# EAGLE board regulator_plus_switch_multi (EAGLE 7.2.0)
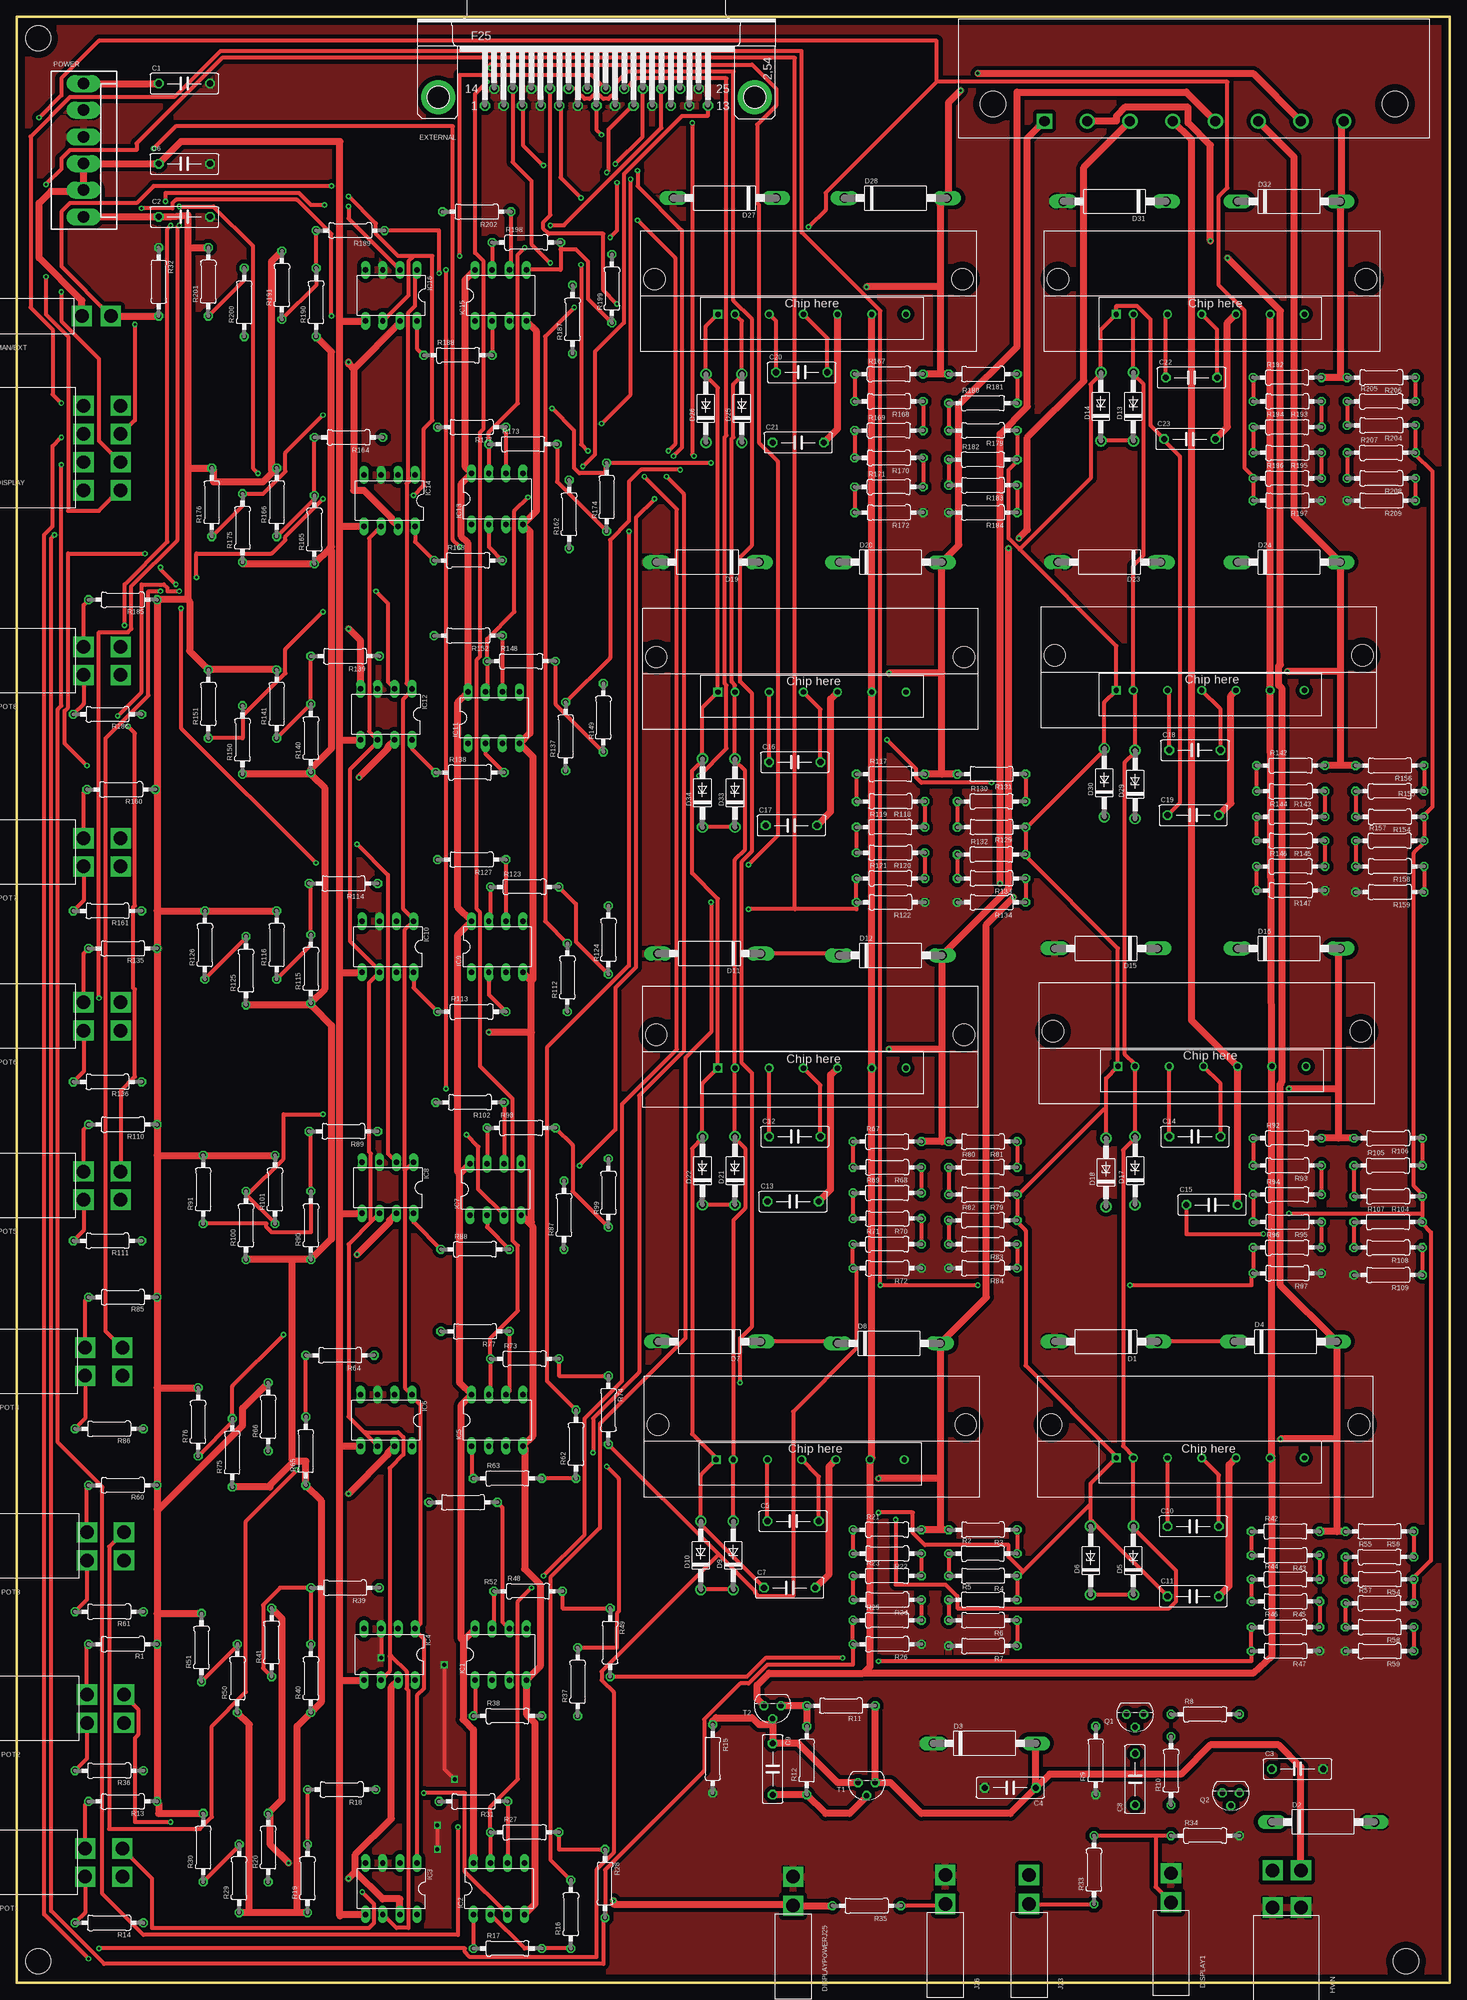
[diagram p2: board, top side]
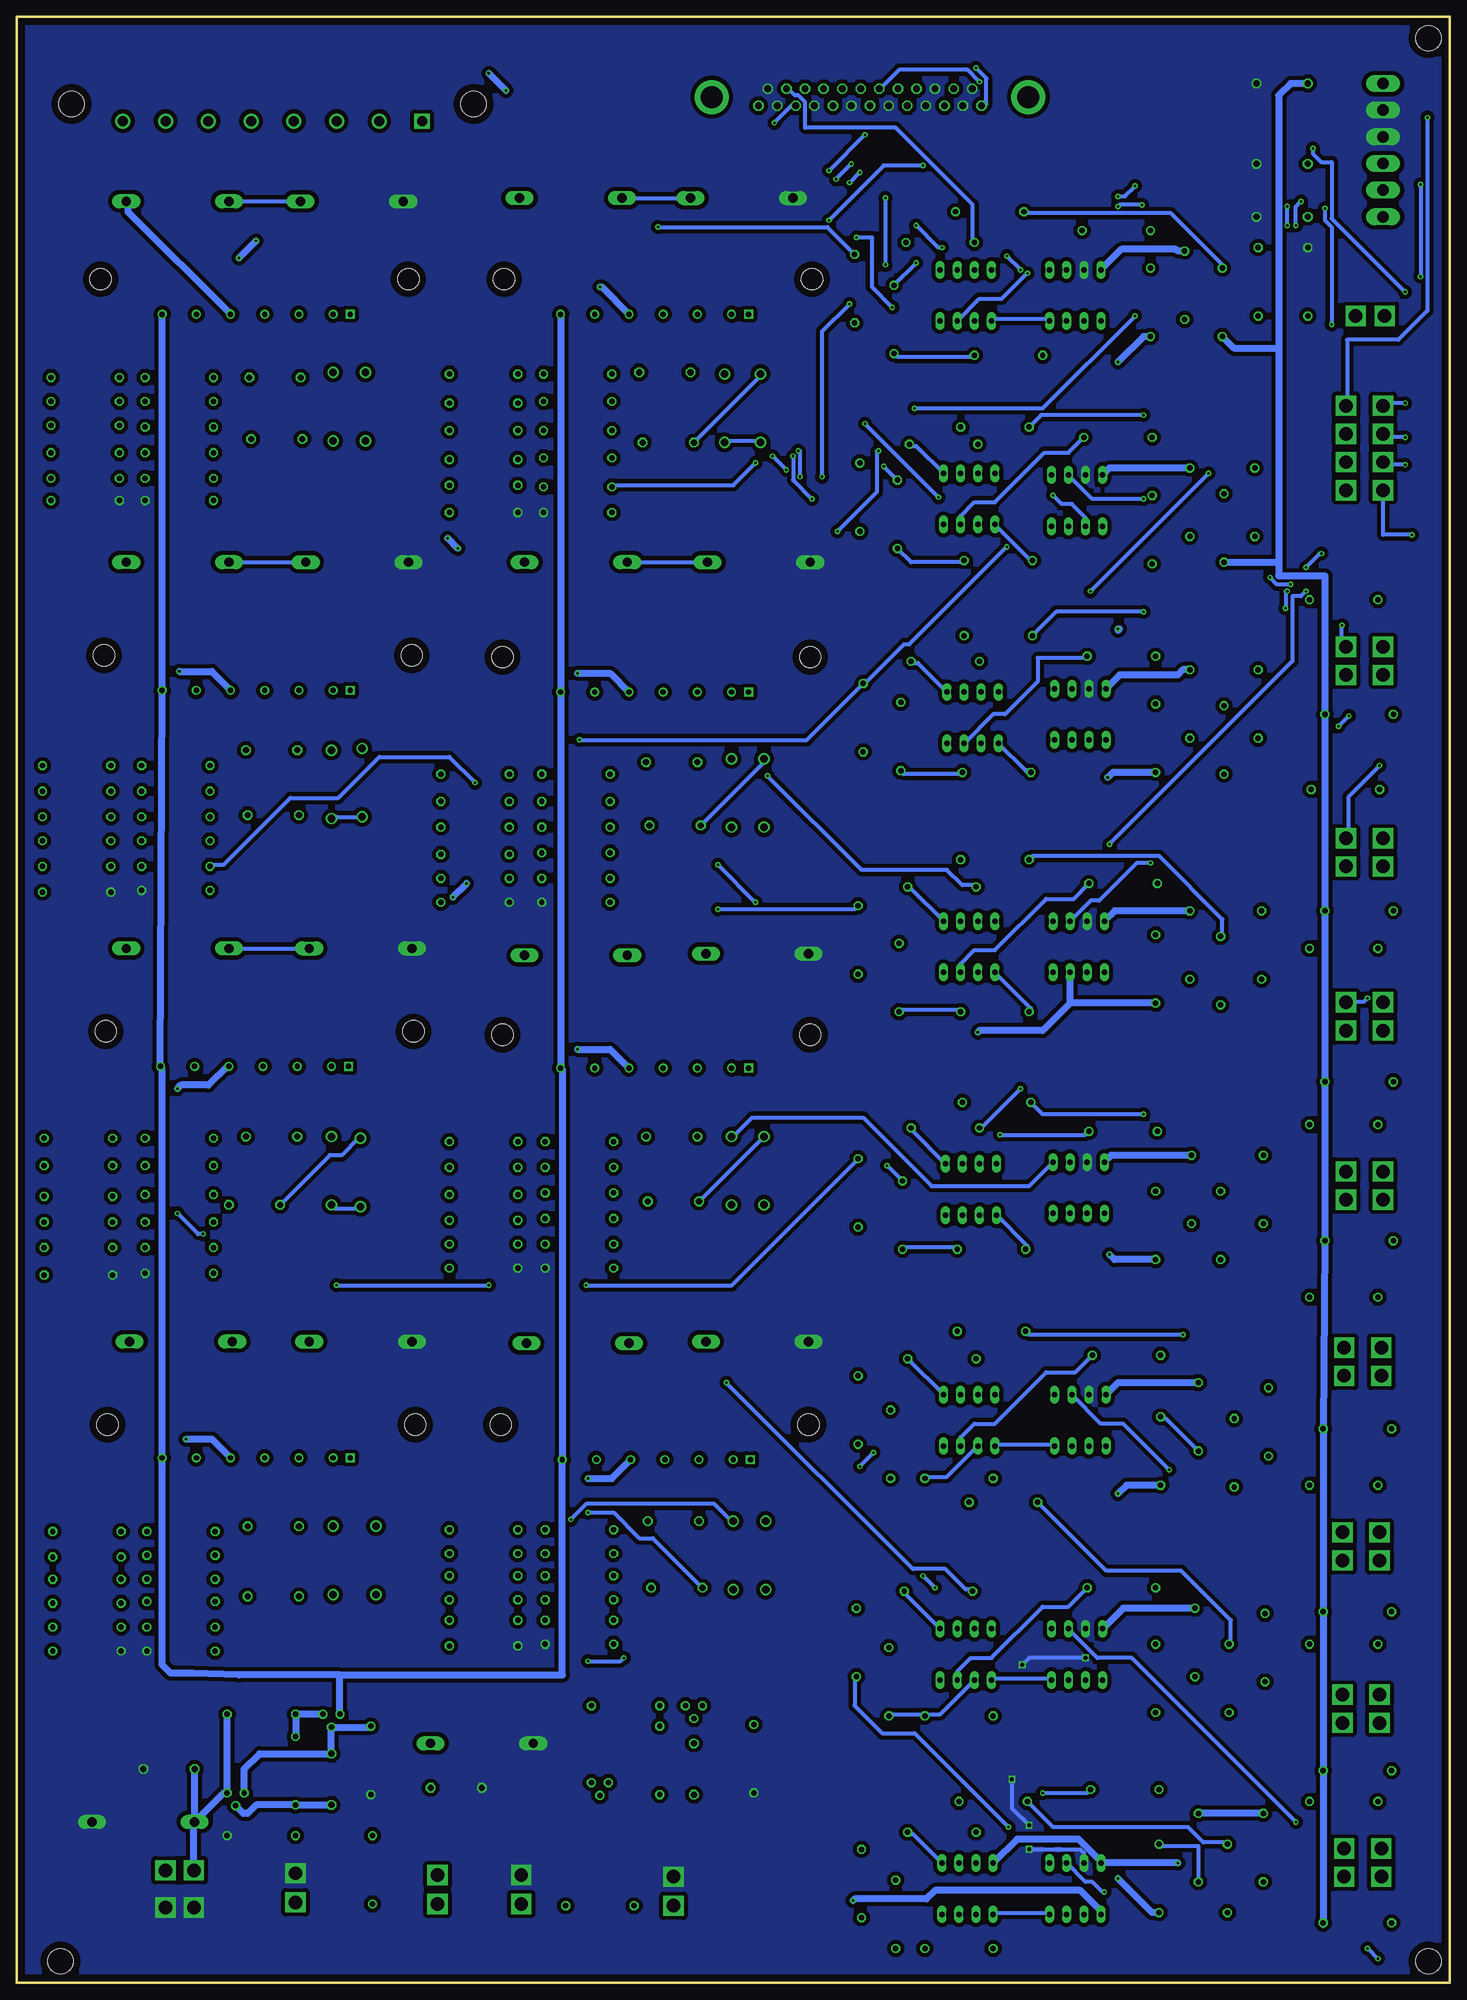
[diagram p3: board, bottom side, seen from below]

Size 212.85 x 292.1 mm. Coordinates in mm from the lower left corner, seen from the top.
Outline: 0,0 212.85,0 212.85,292.1 0,292.1 0,0
Copper layers (1*16): Top 0.035mm / dielectric 1.5mm / Bottom 0.035mm
Design rules "default *": minimum track width 24mil, minimum drill 15mil, track to track 8mil, track to pad 8mil, pad to pad 8mil, via to via 8mil, smd to smd 8mil, copper to edge 40mil, drill to drill 8mil, minimum pad ring 10mil, minimum via ring 8mil, stop-mask expansion 4mil, vias tented up to drill 0mil, thermal gap 10mil
Net classes: 0 default: width 0.61 mm, clearance 0.254 mm; 1 ground: width 0.61 mm, clearance 0.254 mm; 2 power: width 1.016 mm, clearance 0.254 mm
Holes 3.8 mm at 3.17,288.93 206.38,3.17 3.17,3.17

## Footprints (pad centres in the part's own frame; a part is rotated, then mirrored left to right if it is on the bottom)
C075-032X103 = drill 0.914 octagon: 1 -3.81,0; 2 3.81,0
C1702-15 = drill 1.397 long: A 7.62,0; C -7.62,0
DO41Z10 = drill 1.118: A 5.08,0; C -5.08,0
5669-8 = drill 2 square: P$1 0,0; P$2 -4.191,0; P$3 -8.382,0; P$4 -12.573,0; P$5 0,5.512; P$6 -4.191,5.512; P$7 -8.382,5.512; P$8 -12.573,5.512
5569-2 = drill 2 square: P$1 0,0; P$2 0,4.318
F25HP = drill 1.016 octagon: 1 -16.561,-1.27; 2 -13.792,-1.27; 3 -11.049,-1.27; 4 -8.28,-1.27; 5 -5.512,-1.27; 6 -2.769,-1.27; 7 0,-1.27; 8 2.769,-1.27; 9 5.512,-1.27; 10 8.28,-1.27; 11 11.049,-1.27; 12 13.792,-1.27; 13 16.561,-1.27; 14 -15.189,1.27; 15 -12.421,1.27; 16 -9.652,1.27; 17 -6.909,1.27; 18 -4.14,1.27; 19 -1.372,1.27; 20 1.372,1.27; 21 4.14,1.27; 22 6.909,1.27; 23 9.652,1.27; 24 12.421,1.27; 25 15.189,1.27 | drill 3.302 pad 5.08: G1 -23.52,0; G2 23.52,0
5669-4 = drill 2 square: P$1 0,0; P$2 -4.191,0; P$3 0,5.512; P$4 -4.191,5.512
DIL08 = drill 0.813 long: 1 -3.81,-3.81; 2 -1.27,-3.81; 3 1.27,-3.81; 4 3.81,-3.81; 5 3.81,3.81; 6 1.27,3.81; 7 -1.27,3.81; 8 -3.81,3.81
C247-050 = hole 3.2: 2.032,7.239; 47.752,7.239
640584-1 = drill 1.5 square: P$1 0,0 | drill 1.5: P$2 6.35,0; P$3 12.7,0; P$4 19.05,0; P$5 25.4,0; P$6 31.75,0; P$7 38.1,0; P$8 44.45,0 | hole 3.81: -7.62,2.54; 52.07,2.54
KK-156-6 = drill 1.7 pad 2.184 long: 1 -9.9,0; 2 -5.94,0; 3 -1.98,0; 4 1.98,0; 5 5.94,0; 6 9.9,0
TO92 = drill 0.813 octagon: 1 1.27,0; 2 0,1.905; 3 -1.27,0
0207/10 = drill 0.813 octagon: 1 -5.08,0; 2 5.08,0
7SIP = drill 0.8 square: P$1 0,0 | drill 0.8: P$2 2.54,0; P$3 7.62,0; P$4 12.7,0; P$5 17.78,0; P$6 22.86,0; P$7 27.94,0

## Placement (x,y rotation side)
C1  10n  [C075-032X103]  24.89,282.19 0 top
C2  10n  [C075-032X103]  24.89,262.38 0 top
C3  10n  [C075-032X103]  190.25,31.75 0 top
C4  10n  [C075-032X103]  147.57,28.96 180 top
C5  10p  [C075-032X103]  115.32,68.58 0 top
C6  10n  [C075-032X103]  24.89,270.26 0 top
C7  10p  [C075-032X103]  114.81,58.67 0 top
C8  1n  [C075-032X103]  166.12,30.23 90 top
C9  1n  [C075-032X103]  112.27,31.75 270 top
C10  10p  [C075-032X103]  174.75,67.82 0 top
C11  10p  [C075-032X103]  174.75,57.4 0 top
C12  10p  [C075-032X103]  115.57,125.73 0 top
C13  10p  [C075-032X103]  115.32,116.08 0 top
C14  10p  [C075-032X103]  175.01,125.73 0 top
C15  10p  [C075-032X103]  177.55,115.57 0 top
C16  10p  [C075-032X103]  115.57,181.36 0 top
C17  10p  [C075-032X103]  115.06,171.96 0 top
C18  10p  [C075-032X103]  175.01,183.13 0 top
C19  10p  [C075-032X103]  174.75,173.48 0 top
C20  10p  [C075-032X103]  116.59,239.27 0 top
C21  10p  [C075-032X103]  116.08,228.85 0 top
C22  10p  [C075-032X103]  174.5,238.51 0 top
C23  10p  [C075-032X103]  174.24,229.36 0 top
D1  P6KEXXA  [C1702-15]  161.8,95.25 180 top
D2  P6KEXXA  [C1702-15]  194.06,23.88 0 top
D3  P6KEXXA  [C1702-15]  143.76,35.56 0 top
D4  P6KEXXA  [C1702-15]  188.47,95.25 0 top
D5  1n4742  [DO41Z10]  165.86,62.74 90 top
D6  1n4742  [DO41Z10]  159.51,62.74 90 top
D7  P6KEXXA  [C1702-15]  102.87,95.25 180 top
D8  P6KEXXA  [C1702-15]  129.54,95 0 top
D9  1n4742  [DO41Z10]  106.43,63.5 90 top
D10  1n4742  [DO41Z10]  101.6,63.5 90 top
D11  P6KEXXA  [C1702-15]  102.87,152.91 180 top
D12  P6KEXXA  [C1702-15]  129.79,152.65 0 top
D13  1n4742  [DO41Z10]  165.86,234.19 90 top
D14  1n4742  [DO41Z10]  161.04,234.19 90 top
D15  P6KEXXA  [C1702-15]  161.8,153.67 180 top
D16  P6KEXXA  [C1702-15]  188.98,153.67 0 top
D17  1n4742  [DO41Z10]  166.12,120.65 90 top
D18  1n4742  [DO41Z10]  161.8,120.4 90 top
D19  P6KEXXA  [C1702-15]  102.62,211.07 180 top
D20  P6KEXXA  [C1702-15]  129.79,211.07 0 top
D21  1n4742  [DO41Z10]  106.68,120.65 90 top
D22  1n4742  [DO41Z10]  101.85,120.65 90 top
D23  P6KEXXA  [C1702-15]  162.31,211.07 180 top
D24  P6KEXXA  [C1702-15]  188.98,211.07 0 top
D25  1n4742  [DO41Z10]  107.7,233.93 90 top
D26  1n4742  [DO41Z10]  102.36,233.93 90 top
D27  P6KEXXA  [C1702-15]  105.16,265.18 180 top
D28  P6KEXXA  [C1702-15]  130.56,265.18 0 top
D29  1n4742  [DO41Z10]  166.12,178.05 90 top
D30  1n4742  [DO41Z10]  161.54,178.31 90 top
D31  P6KEXXA  [C1702-15]  163.07,264.67 180 top
D32  P6KEXXA  [C1702-15]  188.98,264.67 0 top
D33  1n4742  [DO41Z10]  106.68,176.78 90 top
D34  1n4742  [DO41Z10]  101.85,176.78 90 top
DISPLAY  5669-8  [5669-8]  9.91,221.74 270 top
DISPLAY1  5569-2  [5569-2]  171.45,11.94 0 top
DISPLAYPOWERJ25  5569-2  [5569-2]  115.32,11.43 0 top
EXTERNAL  [F25HP]  86.11,280.16 0 top
HVIN  5569-4  [5669-4]  190.75,11.18 0 top
IC1  LT1352PA  [DIL08]  71.88,48.77 0 top
IC2  LT1352PA  [DIL08]  71.63,13.97 0 top
IC3  DG419DJN  [DIL08]  55.63,13.97 180 top
IC4  DG419DJN  [DIL08]  55.37,48.77 180 top
IC5  LT1352PA  [DIL08]  71.37,83.57 0 top
IC6  DG419DJN  [DIL08]  54.86,83.57 180 top
IC7  LT1352PA  [DIL08]  71.12,117.86 0 top
IC8  DG419DJN  [DIL08]  55.12,118.11 180 top
IC9  LT1352PA  [DIL08]  71.37,153.92 0 top
IC10  DG419DJN  [DIL08]  55.12,153.92 180 top
IC11  LT1352PA  [DIL08]  70.87,187.96 0 top
IC12  DG419DJN  [DIL08]  54.86,188.47 180 top
IC13  LT1352PA  [DIL08]  71.37,220.47 0 top
IC14  DG419DJN  [DIL08]  55.37,220.22 180 top
IC15  LT1352PA  [DIL08]  71.88,250.7 0 top
IC16  DG419DJN  [DIL08]  55.63,250.7 180 top
J23  5569-2  [5569-2]  150.37,11.68 0 top
J26  5569-2  [5569-2]  137.92,11.68 0 top
KK1  SK125/50C247  [C247-050]  143,90.17 180 top
KK2  SK125/50C247  [C247-050]  201.42,90.17 180 top
KK3  SK125/50C247  [C247-050]  142.75,148.08 180 top
KK4  SK125/50C247  [C247-050]  142.75,204.22 180 top
KK5  SK125/50C247  [C247-050]  201.93,204.47 180 top
KK6  SK125/50C247  [C247-050]  142.49,260.35 180 top
KK7  SK125/50C247  [C247-050]  202.44,260.35 180 top
KK8  SK125/50C247  [C247-050]  201.68,148.59 180 top
MAN/EXT  5569-2  [5569-2]  9.65,247.65 270 top
OUT  640584-1  [640584-1]  152.65,276.61 0 top
POT1  5569-4  [5669-4]  10.16,15.75 270 top
POT2  5569-4  [5669-4]  10.41,38.61 270 top
POT3  5569-4  [5669-4]  10.41,62.74 270 top
POT4  5569-4  [5669-4]  10.16,90.17 270 top
POT5  5569-4  [5669-4]  9.91,116.33 270 top
POT6  5569-4  [5669-4]  9.91,141.48 270 top
POT7  5569-4  [5669-4]  9.91,165.86 270 top
POT8  5569-4  [5669-4]  9.91,194.31 270 top
POWER  [KK-156-6]  9.91,272.29 270 top
Q1  STX616-AP  [TO92]  166.12,39.88 180 top
Q2  STX616-AP  [TO92]  180.34,28.19 180 top
R1  20k  [0207/10]  15.75,50.29 180 top
R2  1M  [0207/10]  143.51,63.75 0 top
R3  1M  [0207/10]  143.51,67.31 180 top
R4  1M  [0207/10]  143.51,60.45 180 top
R5  25.5k  [0207/10]  143.51,56.9 0 top
R6  25.5k  [0207/10]  143.51,53.85 180 top
R7  25.5k  [0207/10]  143.51,50.04 180 top
R8  68  [0207/10]  176.53,39.88 0 top
R9  4.99M  [0207/10]  160.27,33.02 90 top
R10  1k  [0207/10]  171.45,31.5 90 top
R11  68  [0207/10]  122.43,41.15 180 top
R12  1k  [0207/10]  117.35,33.02 90 top
R13  20k  [0207/10]  15.75,26.92 180 top
R14  20k  [0207/10]  13.72,8.89 180 top
R15  4.99M  [0207/10]  103.38,33.27 270 top
R16  10k  [0207/10]  82.3,10.16 90 top
R17  40k  [0207/10]  72.9,5.08 0 top
R18  10k  [0207/10]  48.26,28.7 180 top
R19  17k  [0207/10]  43.18,15.49 90 top
R20  13k  [0207/10]  37.34,20.07 90 top
R21  1M  [0207/10]  129.29,67.31 0 top
R22  1M  [0207/10]  129.29,63.75 180 top
R23  1M  [0207/10]  129.29,60.45 0 top
R24  1M  [0207/10]  129.29,56.9 180 top
R25  1M  [0207/10]  129.29,53.85 0 top
R26  100k  [0207/10]  129.29,50.29 180 top
R27  10k  [0207/10]  75.44,22.35 0 top
R28  20k  [0207/10]  87.38,14.73 270 top
R29  16k  [0207/10]  33.02,15.49 90 top
R30  12.75k  [0207/10]  27.69,20.07 90 top
R31  10k  [0207/10]  67.82,26.92 180 top
R32  100k  [0207/10]  21.08,252.73 270 top
R33  90.9k  [0207/10]  160.02,16.76 90 top
R34  10k  [0207/10]  176.53,21.84 0 top
R35  294  [0207/10]  126.24,11.43 180 top
R36  20k  [0207/10]  13.72,31.5 180 top
R37  10k  [0207/10]  83.31,44.7 90 top
R38  40k  [0207/10]  72.9,39.62 0 top
R39  10k  [0207/10]  48.77,58.67 180 top
R40  17k  [0207/10]  43.69,45.21 90 top
R41  13k  [0207/10]  37.85,50.55 90 top
R42  1M  [0207/10]  188.47,67.06 0 top
R43  1M  [0207/10]  188.47,63.5 180 top
R44  1M  [0207/10]  188.47,59.94 0 top
R45  1M  [0207/10]  188.47,56.64 180 top
R46  1M  [0207/10]  188.47,52.83 0 top
R47  100k  [0207/10]  188.47,49.28 180 top
R48  10k  [0207/10]  75.95,58.17 0 top
R49  20k  [0207/10]  88.14,50.55 270 top
R50  16k  [0207/10]  32.77,45.21 90 top
R51  12.75k  [0207/10]  27.43,49.78 90 top
R52  10k  [0207/10]  66.29,71.37 180 top
R54  1M  [0207/10]  202.44,59.94 180 top
R55  1M  [0207/10]  202.44,63.25 0 top
R56  1M  [0207/10]  202.44,67.06 180 top
R57  25.5k  [0207/10]  202.44,56.39 0 top
R58  25.5k  [0207/10]  202.44,52.83 180 top
R59  25.5k  [0207/10]  202.44,49.28 180 top
R60  20k  [0207/10]  15.75,73.91 180 top
R61  20k  [0207/10]  13.72,55.12 180 top
R62  10k  [0207/10]  83.06,80.01 90 top
R63  40k  [0207/10]  72.9,74.93 0 top
R64  10k  [0207/10]  48.01,93.22 180 top
R65  17k  [0207/10]  42.93,78.99 90 top
R66  13k  [0207/10]  37.34,84.07 90 top
R67  1M  [0207/10]  129.29,124.97 0 top
R68  1M  [0207/10]  129.29,121.16 180 top
R69  1M  [0207/10]  129.29,117.35 0 top
R70  1M  [0207/10]  129.29,113.54 180 top
R71  1M  [0207/10]  129.29,109.73 0 top
R72  100k  [0207/10]  129.29,106.17 180 top
R73  10k  [0207/10]  75.44,92.71 0 top
R74  20k  [0207/10]  87.88,85.09 270 top
R75  16k  [0207/10]  32,78.74 90 top
R76  12.75k  [0207/10]  26.92,83.31 90 top
R77  10k  [0207/10]  68.07,96.77 180 top
R79  1M  [0207/10]  143.51,117.09 180 top
R80  1M  [0207/10]  143.51,121.16 0 top
R81  1M  [0207/10]  143.51,124.97 180 top
R82  25.5k  [0207/10]  143.51,113.28 0 top
R83  25.5k  [0207/10]  143.51,109.73 180 top
R84  25.5k  [0207/10]  143.51,106.17 180 top
R85  20k  [0207/10]  15.75,101.85 180 top
R86  20k  [0207/10]  13.72,82.3 180 top
R87  10k  [0207/10]  81.28,114.05 90 top
R88  40k  [0207/10]  68.07,108.97 0 top
R89  10k  [0207/10]  48.51,126.49 180 top
R90  17k  [0207/10]  43.69,112.52 90 top
R91  13k  [0207/10]  27.69,117.86 90 top
R92  1M  [0207/10]  188.72,125.48 0 top
R93  1M  [0207/10]  188.72,121.41 180 top
R94  1M  [0207/10]  188.72,117.09 0 top
R95  1M  [0207/10]  188.72,113.03 180 top
R96  1M  [0207/10]  188.72,109.22 0 top
R97  100k  [0207/10]  188.72,105.41 180 top
R98  10k  [0207/10]  74.93,127 0 top
R99  20k  [0207/10]  87.88,117.35 90 top
R100  16k  [0207/10]  34.04,112.52 90 top
R101  12.75k  [0207/10]  38.35,117.86 90 top
R102  10k  [0207/10]  67.31,130.81 180 top
R104  1M  [0207/10]  203.71,116.84 180 top
R105  1M  [0207/10]  203.71,121.41 0 top
R106  1M  [0207/10]  203.71,125.48 180 top
R107  25.5k  [0207/10]  203.71,113.03 0 top
R108  25.5k  [0207/10]  203.71,109.22 180 top
R109  25.5k  [0207/10]  203.71,105.16 180 top
R110  20k  [0207/10]  15.75,127.51 180 top
R111  20k  [0207/10]  13.46,110.24 180 top
R112  10k  [0207/10]  81.79,149.35 90 top
R113  40k  [0207/10]  67.56,144.27 0 top
R114  10k  [0207/10]  48.51,163.32 180 top
R115  17k  [0207/10]  43.69,150.62 90 top
R116  13k  [0207/10]  38.61,154.18 90 top
R117  1M  [0207/10]  129.79,179.58 0 top
R118  1M  [0207/10]  129.79,175.51 180 top
R119  1M  [0207/10]  129.79,171.7 0 top
R120  1M  [0207/10]  129.79,167.89 180 top
R121  1M  [0207/10]  129.79,164.08 0 top
R122  100k  [0207/10]  129.79,160.53 180 top
R123  10k  [0207/10]  75.44,162.81 0 top
R124  20k  [0207/10]  87.88,154.94 90 top
R125  16k  [0207/10]  34.04,150.37 90 top
R126  12.75k  [0207/10]  27.94,154.18 90 top
R127  10k  [0207/10]  67.56,166.88 180 top
R129  1M  [0207/10]  144.78,171.7 180 top
R130  1M  [0207/10]  144.78,175.51 0 top
R131  1M  [0207/10]  144.78,179.58 180 top
R132  25.5k  [0207/10]  144.78,167.64 0 top
R133  25.5k  [0207/10]  144.78,164.08 180 top
R134  25.5k  [0207/10]  144.78,160.53 180 top
R135  20k  [0207/10]  15.75,153.67 180 top
R136  20k  [0207/10]  13.46,133.86 180 top
R137  10k  [0207/10]  81.53,185.17 90 top
R138  40k  [0207/10]  67.31,179.83 0 top
R139  10k  [0207/10]  48.77,197.1 180 top
R140  17k  [0207/10]  43.69,184.91 90 top
R141  13k  [0207/10]  38.61,189.99 90 top
R142  1M  [0207/10]  189.23,180.85 0 top
R143  1M  [0207/10]  189.23,177.04 180 top
R144  1M  [0207/10]  189.23,173.23 0 top
R145  1M  [0207/10]  189.23,169.67 180 top
R146  1M  [0207/10]  189.23,165.86 0 top
R147  100k  [0207/10]  189.23,162.31 180 top
R148  10k  [0207/10]  74.93,196.34 0 top
R149  20k  [0207/10]  87.12,187.96 90 top
R150  16k  [0207/10]  33.53,184.66 90 top
R151  12.75k  [0207/10]  28.45,189.99 90 top
R152  10k  [0207/10]  67.06,200.15 180 top
R154  1M  [0207/10]  203.96,173.23 180 top
R155  1M  [0207/10]  203.96,177.04 0 top
R156  1M  [0207/10]  203.96,180.85 180 top
R157  25.5k  [0207/10]  203.96,169.67 0 top
R158  25.5k  [0207/10]  203.96,165.86 180 top
R159  25.5k  [0207/10]  203.96,162.05 180 top
R160  20k  [0207/10]  15.49,177.29 180 top
R161  20k  [0207/10]  13.46,159.26 180 top
R162  10k  [0207/10]  82.04,218.19 90 top
R163  40k  [0207/10]  67.06,211.33 0 top
R164  10k  [0207/10]  49.28,229.62 180 top
R165  17k  [0207/10]  44.2,215.9 90 top
R166  13k  [0207/10]  38.61,219.96 90 top
R167  1M  [0207/10]  129.54,239.01 0 top
R168  1M  [0207/10]  129.54,234.95 180 top
R169  1M  [0207/10]  129.54,230.63 0 top
R170  1M  [0207/10]  129.54,226.57 180 top
R171  1M  [0207/10]  129.54,222.25 0 top
R172  100k  [0207/10]  129.54,218.44 180 top
R173  10k  [0207/10]  75.18,228.6 0 top
R174  20k  [0207/10]  87.63,220.73 90 top
R175  16k  [0207/10]  33.53,216.15 90 top
R176  12.75k  [0207/10]  28.96,219.96 90 top
R177  10k  [0207/10]  67.56,231.14 180 top
R179  1M  [0207/10]  143.51,230.63 180 top
R180  1M  [0207/10]  143.51,234.7 0 top
R181  1M  [0207/10]  143.51,239.01 180 top
R182  25.5k  [0207/10]  143.51,226.31 0 top
R183  25.5k  [0207/10]  143.51,222.5 180 top
R184  25.5k  [0207/10]  143.51,218.44 180 top
R185  20k  [0207/10]  15.75,205.49 180 top
R186  20k  [0207/10]  13.46,188.47 180 top
R187  10k  [0207/10]  82.55,247.14 90 top
R188  40k  [0207/10]  65.53,241.81 0 top
R189  10k  [0207/10]  49.53,260.35 180 top
R190  17k  [0207/10]  44.45,249.68 90 top
R191  13k  [0207/10]  39.37,252.22 90 top
R192  1M  [0207/10]  188.72,238.51 0 top
R193  1M  [0207/10]  188.72,234.95 180 top
R194  1M  [0207/10]  188.72,231.14 0 top
R195  1M  [0207/10]  188.72,227.33 180 top
R196  1M  [0207/10]  188.72,223.52 0 top
R197  100k  [0207/10]  188.72,220.22 180 top
R198  10k  [0207/10]  75.69,258.57 0 top
R199  20k  [0207/10]  88.39,251.71 90 top
R200  16k  [0207/10]  33.78,249.68 90 top
R201  12.75k  [0207/10]  28.45,252.73 90 top
R202  10k  [0207/10]  68.33,263.14 180 top
R204  1M  [0207/10]  202.69,231.39 180 top
R205  1M  [0207/10]  202.69,234.95 0 top
R206  1M  [0207/10]  202.69,238.51 180 top
R207  25.5k  [0207/10]  202.69,227.33 0 top
R208  25.5k  [0207/10]  202.69,223.52 180 top
R209  25.5k  [0207/10]  202.69,220.22 180 top
T1  ZTX560  [TO92]  126.24,29.72 180 top
T2  ZTX560  [TO92]  112.27,41.15 180 top
U$1  PA97  [7SIP]  163.32,77.98 0 top
U$2  PA97  [7SIP]  104.14,135.89 0 top
U$3  PA97  [7SIP]  163.58,136.14 0 top
U$4  PA97  [7SIP]  103.89,77.72 0 top
U$5  PA97  [7SIP]  104.14,191.77 0 top
U$6  PA97  [7SIP]  163.32,192.02 0 top
U$7  PA97  [7SIP]  104.14,247.9 0 top
U$8  PA97  [7SIP]  163.32,247.9 0 top

## Tracks (layer width: path | path; a pad name or v marks a point on that pad's centre or on a via)
+5V  (via drill 0.38)
  Top 1.016: MAN/EXT.P$1 9.65,249.94 3.3,256.29 3.3,264.41 5.08,266.19 9.75,266.19 POWER.5 POWER.4 21.03,270.31 C6.1 24.38,273.56 48.01,273.56 48.01,246.89 | 48.01,9.91 48.01,10.16 | 48.01,10.16 48.01,44.96 | 48.01,44.96 48.01,79.76 | 48.01,79.76 48.01,114.3 | 48.01,114.3 48.01,150.11 | 48.01,150.11 48.01,184.66 | 48.01,184.66 48.01,216.41 | 48.01,216.41 48.01,246.89 | R35.2 DISPLAYPOWERJ25.P$1 115.06,11.68 88.65,11.68 v88.65,12.19 | 48.01,79.76 IC6.5 | 48.01,114.3 IC8.5 | 48.01,150.11 IC10.5 | 48.01,184.66 IC12.5 | 48.01,44.96 IC4.5 | 48.01,216.41 IC14.5 | 48.01,10.16 IC3.5 | 48.01,246.89 IC16.5
  Bottom 1.016: v88.65,12.19 88.39,12.45 77.72,12.45 76.45,13.72 54.86,13.72 51.82,10.67 IC3.5
+15V  (via drill 0.38)
  Top 1.016: POWER.6 C2.1 22.86,262.38 25.4,262.64 25.4,257.81 | 25.4,257.81 25.4,225.04 | 25.4,225.04 25.4,205.49 | 25.4,205.49 R185.1 20.83,177.04 | R160.1 20.83,177.04 | 20.83,177.04 20.83,159.26 | 20.83,159.26 R135.1 | 21.08,153.67 R135.1 | R135.1 R110.1 20.83,122.94 | 20.83,122.94 R85.1 20.83,88.39 | 20.83,88.39 R60.1 20.83,70.36 | 20.83,70.36 20.83,54.86 | 20.83,54.86 R1.1 R13.1 21.08,26.67 21.08,25.15 R30.2 | IC15.8 66.55,252.98 66.55,225.3 IC13.8 66.04,222.76 66.04,214.88 67.06,213.87 IC11.8 65.53,190.25 65.53,159.77 IC9.8 65.53,155.7 65.53,120.4 65.79,120.14 | 65.79,120.14 IC7.8 | 65.79,120.14 65.79,89.15 IC5.8 66.04,85.85 66.04,51.05 66.29,50.8 | IC2.8 67.82,37.59 66.29,39.12 66.29,50.8 | IC1.8 66.29,50.8 | R41.2 39.37,54.1 39.37,27.18 R20.2 37.59,24.89 37.59,20.57 v40.39,17.78 | v49.28,201.17 51.05,199.39 IC12.4 | R141.2 R151.2 25.65,197.87 25.65,205.23 25.4,205.49 | 20.83,54.86 R51.2 | 20.83,88.39 R76.2 | R66.2 33.53,85.34 33.53,82.8 21.08,70.36 20.83,70.36 | 20.83,122.94 R91.2 R101.2 | 20.83,159.26 R126.2 R116.2 | 25.4,225.04 R176.2 29.21,224.79 29.21,223.01 36.58,223.01 38.1,224.54 | 25.4,257.81 R201.2 | 38.1,224.54 R166.2 | R191.2 37.85,255.78 37.85,224.79 38.1,224.54
  Bottom 1.016: 49.28,200.91 49.15,201.04 | 49.15,201.04 49.02,201.17 | IC4.4 48.51,55.63 R41.2 | v40.39,17.78 IC3.4 51.82,18.03 55.12,21.34 64.26,21.34 IC2.8 | v49.28,201.17 49.15,201.04 | IC12.4 49.02,194.31 40.39,194.31 39.62,195.07 R141.2 | IC6.4 49.28,89.15 R66.2 | IC8.4 50.29,122.94 R101.2 | IC10.4 49.78,159.26 R116.2 | IC14.4 50.55,225.04 R166.2 | IC16.4 48.77,257.56 40.64,257.56 40.39,257.3 R191.2 | R30.2 R20.2
-15V  (via drill 0.38, 0.6)
  Top 1.016: POWER.1 C1.1 | IC15.4 77.22,245.36 77.22,218.69 IC13.4 76.2,215.65 76.2,185.67 IC11.4 76.71,182.12 76.71,149.1 76.45,148.84 | IC2.4 76.96,11.68 76.96,38.61 75.69,39.88 IC1.4 77.72,46.99 77.72,59.18 75.44,61.47 75.44,79.5 IC5.4 76.71,81.28 76.71,112.27 76.2,112.78 | 76.2,112.78 IC7.4 | 76.45,148.84 IC9.4 | 76.45,141.22 76.45,113.03 76.2,112.78 | 76.45,141.22 76.45,148.84 | IC4.7 55.63,43.94 55.63,24.38 50.29,19.05 50.29,16.51 | 50.29,16.51 54.36,12.45 56.9,12.45 IC3.7 | R19.1 41.66,10.41 | 41.66,10.41 34.54,10.41 | 34.54,10.41 R29.1 | R50.1 34.54,38.35 34.54,10.41 | 41.66,10.41 41.66,38.1 R40.1 45.21,41.66 45.21,71.63 R65.1 42.93,77.47 41.15,77.47 | v49.28,15.49 50.29,16.51 | 40.89,107.44 R90.1 46.74,110.49 46.74,142.24 43.94,145.03 R115.1 | 40.89,107.44 R100.1 | IC8.7 55.37,113.28 55.37,113.03 v50.55,108.2 | R75.1 37.59,73.66 37.59,73.91 41.15,77.47 | IC6.7 55.12,78.74 55.12,78.49 v49.28,72.64 | 40.89,107.44 40.89,77.72 41.15,77.47 | R125.1 43.69,145.29 R115.1 | R150.1 43.69,179.58 R140.1 | IC12.7 55.12,183.64 55.12,183.39 v50.8,179.07 | R115.1 45.72,147.57 45.72,177.55 43.94,179.32 R140.1 | IC14.7 55.63,217.42 55.63,217.68 51.56,221.74 50.04,221.74 50.04,239.78 | 50.04,239.78 56.9,246.63 IC16.7 | R175.1 33.53,210.82 R165.1 46.48,213.11 | R190.1 46.74,242.32 46.74,213.36 46.48,213.11 | 50.04,239.78 49.28,240.54 v49.28,240.79 | R140.1 43.69,180.34 46.74,183.39 46.74,212.85 46.48,213.11 | v70.1,141.22 76.45,141.22
  Bottom 1.016: C1.1 23.63,282.19 25.4,280.42 25.4,242.82 | 25.4,242.82 25.4,211.07 | 25.4,211.07 25.4,209.04 18.54,209.04 R186.1 R161.1 R136.1 R111.1 18.54,109.98 R86.1 R61.1 R36.1 R14.1 18.8,8.64 | v49.28,15.49 44.2,10.41 R19.1 | v50.55,108.2 49.78,107.44 R90.1 | v49.28,72.64 48.01,73.91 R65.1 | 56.39,145.54 IC10.7 | R115.1 56.39,145.54 | v50.8,179.07 50.04,179.83 R140.1 | R200.1 32,242.82 25.4,242.82 | R175.1 25.4,211.07 | v49.28,240.79 45.47,244.6 R190.1 | v70.1,141.22 69.85,141.48 60.45,141.48 56.39,145.54
  other vias: 21.08,282.19
CMD1  (via drill 0.38)
  Top 0.61: R16.2 79.25,18.29 79.25,60.2 86.61,67.56 86.61,83.06 99.31,95.76 99.31,137.41 103.12,141.22 v103.12,160.53 | v108.71,166.12 113.03,170.43 113.03,226.06 110.24,228.85 110.24,264.16 109.98,264.41 109.98,276.1 112.78,278.89 112.78,281.43 109.22,284.99 70.36,284.99 v70.36,284.48
  Bottom 0.61: v108.71,166.12 v103.12,160.53 | v70.36,284.48 68.83,282.96 68.83,279.15 69.09,278.89 EXTERNAL.1
CMD2  (via drill 0.38)
  Top 0.61: R37.2 89.15,49.78 89.15,54.86 89.41,55.12 89.41,74.93 v87.63,76.71 | v85.6,78.74 85.6,83.82 92.46,90.68 92.46,131.83 99.06,138.43 99.06,221.23 v96.52,223.77 | v96.77,227.58 97.79,228.6 97.79,256.29 v92.2,261.87 | v78.23,270 75.18,273.05 75.18,278.89 EXTERNAL.3
  Bottom 0.61: v85.6,78.74 v87.63,76.71 | v96.52,223.77 96.52,227.58 v96.77,227.58 | v92.2,261.87 84.07,270 v78.23,270
CMD3  (via drill 0.38)
  Top 0.61: R62.2 78.74,89.41 78.74,138.94 90.93,151.13 v90.93,215.65 | v84.84,227.58 83.82,228.6 v83.82,255.27 | v83.82,265.18 80.77,268.22 80.77,278.89 EXTERNAL.5
  Bottom 0.61: v90.93,215.65 85.09,221.49 85.09,227.58 v84.84,227.58 | v83.82,265.18 v83.82,255.27
CMD4  (via drill 0.38)
  Top 0.61: v83.57,121.41 88.9,126.75 88.9,147.83 91.95,150.88 91.95,217.68 v94.74,220.47 | v97.54,226.82 98.81,228.09 98.81,260.35 92.2,266.95 v92.2,269.24 | v86.87,274.57 86.11,275.34 EXTERNAL.7
  Bottom 0.61: v83.57,121.41 R87.2 | v94.74,220.47 97.54,223.27 v97.54,226.82 | v86.87,274.57 v92.2,269.24
CMD5  (via drill 0.38)
  Top 0.61: R112.2 78.49,157.73 78.49,244.6 v82.8,248.92 | v88.14,259.33 89.15,260.35 v89.15,267.46 | v87.63,268.99 87.88,269.24 87.88,275.34 91.44,278.89 EXTERNAL.9
  Bottom 0.61: v82.8,248.92 85.85,251.97 85.85,259.33 v88.14,259.33 | v87.63,268.99 v89.15,267.46
CMD6  (via drill 0.38)
  Top 0.61: R137.2 88.14,196.85 88.14,214.38 90.93,217.17 90.93,223.01 92.71,224.79 v98.55,224.79 | v100.58,226.82 100.33,227.08 v100.33,276.35
  Bottom 0.61: v100.58,226.82 v98.55,224.79 | v100.33,276.35 97.79,278.89 EXTERNAL.11
CMD7  (via drill 0.38)
  Top 0.61: v84.07,225.3 85.85,227.08 85.85,242.32 90.17,246.63 90.17,268.73 98.81,277.37 102.62,277.37 102.62,278.89 EXTERNAL.13
  Bottom 0.61: v84.07,225.3 R162.2
CMD8  (via drill 0.38)
  Top 0.61: v79.25,255.52 76.45,258.32 76.45,267.72 73.66,270.51 73.66,281.43 EXTERNAL.15
  Bottom 0.61: v79.25,255.52 R187.2
GND  (via drill 0.6)
  Top 0.61: IC4.3 v54.1,48.26 | v63.5,47.24 63.5,31.75 v65.02,30.23 | v62.48,23.37 v62.48,19.81
  Bottom 0.61: v54.1,48.26 62.48,48.26 v63.5,47.24 | v65.02,30.23 65.02,25.91 v62.48,23.37 | v62.48,19.81 54.86,19.81 54.36,19.3 IC3.3
  pour Bottom (isolate 0.61, no thermals): 0,0 212.85,0 212.85,292.1 0,292.1
  pour Top (isolate 0.61): 0.25,292.1 213.11,292.1 213.11,0 0.25,0
MAN  (via drill 0.38)
  Top 0.61: IC14.6 52.32,214.63 52.32,185.93 IC12.6 53.59,184.4 49.53,180.34 49.53,154.69 53.85,150.37 IC10.6 52.32,148.59 52.32,123.44 52.58,123.19 52.58,113.28 52.7,113.16 | IC16.6 58.17,250.7 58.17,255.78 58.8,256.41 | 58.8,256.41 58.93,256.54 61.72,256.54 61.72,232.16 60.45,230.89 60.45,222.5 v58.93,220.98 | MAN/EXT.P$2 6.6,255.02 6.6,263.14 7.87,264.41 17.78,264.41 20.32,266.95 v46.74,266.95 | v49.28,265.43 53.34,261.37 53.34,259.84 56.64,256.54 58.67,256.54 58.8,256.41 | 51.69,81.66 49.28,84.07 49.28,109.73 52.7,113.16 | 51.69,81.66 IC6.6 | IC8.6 52.7,113.16 | IC4.6 55.37,46.23 55.37,48.51 | 55.37,48.51 55.37,76.45 57.4,78.49 57.4,81.03 56.64,81.79 51.82,81.79 51.69,81.66 | IC3.6 56.39,8.13 58.17,8.13 58.17,43.43 57.91,43.69 57.91,46.23 55.63,48.51 55.37,48.51
  Top 1.016: MAN/EXT.P$2 R32.2
  Bottom 0.61: v58.93,220.98 57.66,219.71 56.13,219.71 54.1,217.68 IC14.6 | v46.74,266.95 48.26,265.43 v49.28,265.43
N$1
  Top 1.016: R12.2 R11.2 T2.3
N$2
  Bottom 1.016: C8.1 R10.1 177.29,26.42 178.56,25.15 179.2,25.15 Q2.2
N$3
  Top 0.61: C5.1 U$4.P$3
N$4
  Top 0.61: U$4.P$4 119.13,75.18 C5.2
N$5
  Bottom 1.016: R10.2 R8.1 Q1.3
N$6
  Bottom 0.61: R37.1 83.06,39.62 82.8,39.88 78.23,39.88 R38.2 77.98,39.88 75.69,39.88 IC1.2
N$7
  Bottom 0.61: R39.1 56.64,55.88 60.45,55.88 68.07,48.26 71.12,48.26 73.15,46.23 IC1.3
N$8
  Top 0.61: D7.C 121.92,95.25 D8.C
N$9
  Top 0.61: R13.2 10.16,26.42 POT1.P$2
N$10
  Bottom 1.016: Q2.1 179.07,31.75 176.78,34.04 C8.2 Q1.2 160.4,37.97 R9.2
N$11  (via drill 0.38)
  Top 1.016: U$4.P$5 120.65,76.71 120.65,60.71 C7.2 | R3.2 137.16,67.31 | 137.16,67.31 R21.2 | 137.16,74.93 D8.A 144.02,101.85 144.02,157.23 v148.08,161.29 | 137.16,74.93 137.16,67.31 | OUT.P$1 150.11,274.07 150.11,234.19 146.05,230.12 v146.05,163.32 | 137.16,74.93 v128.02,74.93
  Bottom 1.016: v148.08,161.29 v146.05,163.32 | U$4.P$5 124.46,74.93 v128.02,74.93
N$12
  Top 0.61: R2.1 R4.2
N$13  (via drill 0.38)
  Top 0.61: v51.31,13.46 53.09,11.68 53.09,8.89 52.32,8.13 20.07,8.13 20.07,15.49 15.75,19.81 POT1.P$4
  Bottom 0.61: IC3.2 54.1,14.99 53.09,14.99 51.56,13.46 v51.31,13.46
N$14
  Top 0.61: R5.1 R6.2
N$15
  Top 0.61: R14.2 10.16,10.41 POT1.P$1
N$16
  Top 0.61: R6.1 R7.1
N$17
  Top 1.016: T1.2 126.24,27.69 123.7,25.15 120.14,25.15 R12.1 C9.2
N$18
  Top 0.61: R3.1 R2.2
N$19
  Top 1.016: T2.2 112.27,38.35 | 112.27,38.35 C9.1 116.08,35.56 121.92,29.72 T1.1 | R15.1 103.38,38.86 103.89,39.37 109.22,39.37 110.24,38.35 112.27,38.35
N$20
  Top 0.61: R34.1 169.16,21.84 | 169.16,21.84 R33.2 | DISPLAY1.P$1 169.16,14.22 169.16,21.84
N$21
  Top 0.61: J23.P$1 R33.1
N$22
  Top 0.61: R35.1 137.92,11.43 J26.P$1
N$23
  Top 0.61: R41.1 36.58,46.74 36.58,56.13 39.12,58.67 R39.2 R40.2
N$24
  Top 0.61: R16.1 R17.2 75.44,5.08 IC2.2
N$25  (via drill 0.38)
  Top 0.61: v60.45,28.19 66.55,28.19 66.55,16.51 IC2.3
  Bottom 0.61: R18.1 53.85,28.19 v60.45,28.19
N$26
  Top 0.61: R19.2 R18.2
  Bottom 0.61: R20.1 37.34,20.32 42.67,20.32 42.93,20.57 R19.2
N$27
  Top 0.61: IC2.1 R17.1
  Bottom 0.61: IC3.8 59.69,10.41 67.56,10.41 IC2.1
N$28
  Top 0.61: R38.1 68.07,39.88 IC1.1
  Bottom 0.61: IC4.8 59.44,45.21 67.82,45.21 IC1.1
N$29
  Top 0.61: D9.C D10.C
N$30
  Top 0.61: R21.1 R22.2
N$31
  Top 0.61: R22.1 R23.2
N$32
  Top 0.61: R23.1 R24.2
N$33
  Top 0.61: R24.1 R25.2
N$34  (via drill 0.38)
  Top 0.61: R25.1 R26.2 124.21,47.24 111.51,47.24 108.71,44.45 107.44,44.45 102.11,39.12 102.11,31.5 87.38,16.76 R28.2 87.12,9.65 87.12,2.79 12.95,2.79 5.08,10.67 5.08,214.63 v5.59,215.14
  Bottom 0.61: DISPLAY.P$1 9.91,215.14 v5.59,215.14
N$35  (via drill 0.38)
  Top 0.61: IC2.7 R27.1 70.36,26.16 74.42,30.23 74.42,56.64 v76.45,58.67 | v89.15,249.43 87.12,251.46 87.12,259.84 78.99,259.84 78.23,260.6 78.23,261.62 79.25,262.64 79.25,281.43 EXTERNAL.17 | v93.22,223.77 98.04,218.95 98.04,138.68 89.92,130.56 89.92,89.41 84.33,83.82 84.33,66.55 v78.23,60.45
  Bottom 0.61: v89.15,249.43 93.22,245.36 v93.22,223.77 | v76.45,58.67 v78.23,60.45
N$36
  Top 0.61: R30.1 33.02,20.32 R29.2
  Bottom 0.61: R31.2 58.93,23.11 38.86,23.11 36.58,20.83 33.53,20.83 33.27,20.57 R29.2
N$37
  Top 0.61: R31.1 IC2.6
N$38
  Top 0.61: R42.1 R43.2
N$39
  Top 0.61: R28.1 80.52,19.81 R27.2
  Bottom 0.61: IC2.5 79.76,22.1 80.01,22.1 80.26,22.35 R27.2
N$40
  Top 0.61: R43.1 R44.2
N$41
  Top 0.61: R44.1 R45.2
N$42
  Top 0.61: R45.1 R46.2
N$43  (via drill 0.38)
  Top 0.61: R49.2 108.46,45.47 111.25,48.26 v122.68,48.26 | v128.02,47.75 183.39,47.75 R47.2 R46.1 | v6.6,225.55 6.6,189.74 6.1,189.23 6.1,80.26 12.7,73.66 12.7,13.21 18.8,7.11 65.53,7.11 v65.53,23.11
  Bottom 0.61: v122.68,48.26 123.19,47.75 v128.02,47.75 | v6.6,225.55 9.65,225.55 9.91,225.81 DISPLAY.P$2 | v65.53,23.11 79.5,37.08 84.33,37.08 88.39,41.15 88.39,45.47 R49.2
N$44  (via drill 0.38)
  Top 0.61: IC1.7 70.87,52.83 R48.1 | EXTERNAL.18 83.31,281.43 83.31,280.92 84.33,279.91 85.09,279.91 85.6,280.42 86.61,280.42 87.12,279.91 87.88,279.91 88.9,280.92 88.9,282.19 90.68,283.97 106.43,283.97 106.43,249.94 109.22,247.14 109.22,213.61 107.44,211.84 107.44,193.29 109.22,191.52 109.22,168.15 107.7,166.62 107.7,136.65 109.22,135.13 109.22,97.54 107.44,95.76 v107.44,89.15
  Bottom 0.61: v107.44,89.15 79.76,61.47 74.93,61.47 71.88,58.42 71.37,58.42 71.12,58.17 R48.1
N$45
  Top 0.61: R51.1 32.77,50.04 R50.2
  Bottom 0.61: R52.2 51.05,61.21 39.88,61.21 32.51,53.85 32.51,50.29 R50.2
N$46
  Top 0.61: IC1.6 72.14,53.59 72.14,70.61 R52.1
N$47
  Top 0.61: R49.1 81.03,55.63 R48.2
  Bottom 0.61: IC1.5 81.03,57.91 R48.2
N$48
  Top 0.61: R1.2 10.41,50.04 POT2.P$2
N$49  (via drill 0.38)
  Top 0.61: v22.86,23.88 17.53,23.88 17.53,36.32 18.03,36.83 18.03,40.64 16,42.67 POT2.P$4
  Bottom 0.61: IC4.2 52.32,48.26 47.24,48.26 v22.86,23.88
N$50
  Top 0.61: R36.2 10.41,33.27 POT2.P$1
N$51
  Top 0.61: C10.1 U$1.P$3
N$52
  Top 0.61: U$1.P$4 178.56,75.44 C10.2
N$53  (via drill 0.38)
  Top 1.016: U$1.P$5 180.09,76.96 180.09,58.93 C11.2 | R56.2 196.09,67.06 | 196.09,67.06 R42.2 | 196.09,80.77 D4.A 187.71,103.63 187.71,133.6 187.96,133.86 187.96,192.28 187.45,192.79 187.45,195.58 187.71,195.83 187.71,248.41 v179.83,256.29 | 196.09,80.77 196.09,67.06 | OUT.P$2 163.32,276.61 163.32,277.37 164.59,278.64 173.99,278.64 173.99,276.35 177.29,273.05 v177.29,258.83 | 196.09,80.77 v187.71,80.77
  Bottom 1.016: v179.83,256.29 v177.29,258.83 | U$1.P$5 183.9,80.77 v187.71,80.77
N$54
  Top 0.61: D4.C D1.C
N$55
  Top 0.61: R55.1 R54.2
N$56
  Top 0.61: R57.1 R58.2
N$57
  Top 0.61: R58.1 R59.1
N$58
  Top 0.61: R56.1 R55.2
N$59
  Top 0.61: D5.C D6.C
N$60
  Top 0.61: R62.1 R63.2
  Bottom 0.61: IC5.2 74.68,75.18 77.47,75.18 77.72,74.93 R63.2
N$61
  Bottom 0.61: R64.1 55.63,90.68 59.94,90.68 67.56,83.06 70.61,83.06 72.64,81.03 IC5.3
N$62
  Top 0.61: R65.2 R64.2
  Bottom 0.61: R66.1 42.16,83.82 42.42,83.82 42.67,84.07 R65.2
N$63
  Top 0.61: R63.1 67.56,75.18 IC5.1
  Bottom 0.61: IC6.8 58.93,80.01 67.31,80.01 IC5.1
N$64
  Top 0.61: R67.1 R68.2
N$65
  Top 0.61: R68.1 R69.2
N$66
  Top 0.61: R69.1 R70.2
N$67
  Top 0.61: R70.1 R71.2
N$68  (via drill 0.38)
  Top 0.61: 104.27,63.63 109.73,58.17 109.73,57.91 110.24,57.4 115.32,57.4 115.32,84.84 124.71,94.23 124.71,105.66 R72.2 R71.1 | 104.27,63.63 R74.2 | v6.6,229.62 5.33,228.35 5.33,216.41 4.06,215.14 4.06,10.16 v10.67,3.56 | v12.19,5.08 66.55,5.08 66.55,4.57 67.31,3.81 86.11,3.81 86.11,16.76 88.65,19.3 88.65,43.18 86.87,44.96 86.87,46.23 104.27,63.63
  Bottom 0.61: DISPLAY.P$3 9.4,229.62 v6.6,229.62 | v12.19,5.08 v10.67,3.56
N$69  (via drill 0.38)
  Top 0.61: IC5.7 70.36,87.63 R73.1 70.36,95.76 74.42,99.82 74.42,109.47 73.66,110.24 73.66,131.32 68.83,136.14 68.83,159 68.33,159.51 68.33,196.6 68.83,197.1 68.83,230.38 69.34,230.89 69.34,255.78 68.07,257.05 68.07,280.67 v69.85,282.45
  Bottom 0.61: v69.85,282.45 71.63,284.23 81.79,284.23 84.58,281.43 EXTERNAL.19
N$70  (via drill 0.38)
  Top 0.61: R76.1 32,83.31 R75.2 32,88.65 v39.62,96.27
  Bottom 0.61: R77.2 62.48,96.27 v39.62,96.27
N$71
  Top 0.61: IC5.6 73.15,87.88 R77.1
N$72
  Top 0.61: R74.1 80.52,90.17 R73.2
  Bottom 0.61: R73.2 IC5.5
N$73
  Top 0.61: R60.2 10.41,73.66 POT3.P$2
N$74  (via drill 0.38)
  Top 0.61: v41.66,76.2 34.04,68.58 34.04,43.18 28.96,38.1 28.96,24.64 27.18,22.86 13.72,22.86 13.72,64.77 15.75,66.8 POT3.P$4
  Bottom 0.61: IC6.2 51.82,83.06 48.51,83.06 v41.66,76.2
N$75
  Top 0.61: R61.2 10.41,56.9 POT3.P$1
N$76
  Top 0.61: C12.1 U$2.P$3
N$77
  Top 0.61: U$2.P$4 119.38,133.35 C12.2
N$78  (via drill 0.38)
  Top 1.016: U$2.P$5 120.9,134.87 120.9,117.86 C13.2 | R81.2 137.41,124.97 | 137.41,124.97 R67.2 | 137.41,138.68 D12.A 147.32,162.56 v147.32,213.11 | 137.41,138.68 137.41,124.97 | OUT.P$3 158.5,269.75 158.5,238 150.11,229.62 150.11,215.9 v148.84,214.63 | 137.41,138.68 v129.54,138.68
  Bottom 1.016: v147.32,213.11 v148.84,214.63 | U$2.P$5 124.71,138.68 v129.54,138.68
N$79
  Top 0.61: D11.C 122.17,152.91 D12.C
N$80
  Top 0.61: R80.1 R79.2
N$81
  Top 0.61: R82.1 R83.2
N$82
  Top 0.61: R83.1 R84.1
N$83
  Top 0.61: R81.1 R80.2
N$84
  Top 0.61: D13.C D14.C
N$85
  Top 0.61: R88.2 69.85,112.27 IC7.2
  Bottom 0.61: R87.1 81.03,109.22 73.66,109.22 73.41,108.97 R88.2
N$86  (via drill 0.38)
  Top 0.61: v66.8,125.98 68.58,124.21 68.58,117.86 IC7.3
  Bottom 0.61: R89.1 54.1,125.98 v66.8,125.98
N$87
  Top 0.61: R91.1 37.08,112.78 37.08,112.27 37.85,111.51 43.69,111.51 R90.2 43.69,126.24 R89.2
N$88
  Top 0.61: R88.1 58.93,113.03 IC8.8
  Bottom 0.61: IC7.1 62.74,109.47 62.74,108.97 R88.1
N$89
  Top 0.61: R92.1 R93.2
N$90
  Top 0.61: R93.1 R94.2
N$91
  Top 0.61: R94.1 R95.2
N$92
  Top 0.61: R95.1 R96.2
N$93  (via drill 0.38)
  Top 0.61: R96.1 R97.2 183.39,105.41 183.39,103.63 v165.35,103.63 | v142.75,103.63 v128.27,103.63 128.27,248.41 116.59,260.1 116.59,287.02 30.23,287.02 23.37,280.16 7.87,280.16 2.03,274.32 2.03,248.92 5.33,245.62 5.33,235.97 v6.6,234.7
  Bottom 0.61: R99.2 106.68,103.63 v128.27,103.63 | v165.35,103.63 v142.75,103.63 | v6.6,234.7 9.65,234.7 9.91,234.44 DISPLAY.P$4
N$94  (via drill 0.38)
  Top 0.61: R98.1 IC7.7 | v65.79,256.54 65.79,283.46 85.34,283.46 87.38,281.43 EXTERNAL.20 | v63.75,132.84 v63.75,254.51
  Bottom 0.61: v63.75,254.51 v65.79,256.54 | v63.75,132.84 69.6,127 R98.1
N$95  (via drill 0.38)
  Top 0.61: R101.1 34.04,117.09 R100.2 34.29,117.09 39.62,122.43 39.62,129.03 v45.47,129.03
  Bottom 0.61: R102.2 60.45,129.03 v45.47,129.03
N$96
  Top 0.61: R102.1 IC7.6
N$97
  Top 0.61: R99.1 82.55,117.6 82.55,124.46 R98.2
  Bottom 0.61: IC7.5 80.01,126.75 R98.2
N$98
  Top 0.61: R85.2 10.16,101.35 POT4.P$2
N$99  (via drill 0.38)
  Top 0.61: IC8.2 55.12,123.19 55.12,164.59 v50.55,169.16 | v21.34,206.76 19.56,206.76 19.56,191.26 13.21,184.91 13.21,96.77 15.49,94.49 POT4.P$4
  Bottom 0.61: v50.55,169.16 23.37,196.34 23.37,205.99 22.1,205.99 v21.34,206.76
N$100
  Top 0.61: R86.2 10.16,83.82 POT4.P$1
N$101
  Top 0.61: C14.1 U$3.P$3
N$102
  Top 0.61: U$3.P$4 178.82,133.6 C14.2
N$103  (via drill 0.38)
  Top 1.016: R106.2 196.34,125.48 | 196.34,125.48 R92.2 | D16.A 196.34,153.42 196.34,132.84 | 196.34,125.48 196.34,132.84 | C15.2 U$3.P$5 174.5,143 174.5,273.81 OUT.P$4 | v188.98,132.84 196.34,132.84
  Bottom 1.016: v188.98,132.84 188.47,133.35 184.4,133.35 181.61,136.14 U$3.P$5
N$104
  Bottom 0.61: D16.C D15.C
N$105
  Top 0.61: R105.1 R104.2
N$106
  Top 0.61: R107.1 R108.2
N$107
  Top 0.61: R108.1 R109.1
N$108
  Top 0.61: R106.1 R105.2
N$109
  Bottom 0.61: D18.C 162.05,115.06 165.61,115.06 D17.C
N$110
  Top 0.61: R113.2 70.1,146.81 IC9.2
  Bottom 0.61: R112.1 81.53,144.53 73.15,144.53 72.9,144.27 R113.2
N$111
  Bottom 0.61: R114.1 55.88,161.04 59.94,161.04 67.56,153.42 70.61,153.42 72.64,151.38 IC9.3
N$112
  Top 0.61: R116.1 43.69,154.18 R115.2 43.69,163.07 R114.2
N$113
  Top 0.61: R113.1 58.93,147.83 IC10.8
  Bottom 0.61: IC9.1 62.23,144.78 62.23,144.27 R113.1
N$114
  Top 0.61: R117.1 R118.2
N$115
  Top 0.61: R118.1 R119.2
N$116
  Top 0.61: R119.1 R120.2
N$117
  Top 0.61: R120.1 R121.2
N$118  (via drill 0.38)
  Top 0.61: 115.57,159.51 124.71,159.51 R122.2 R121.1 | 115.57,159.51 v108.71,159.51 | v4.32,253.49 4.32,247.9 7.62,244.6 7.62,218.69 12.19,218.69 15.24,221.74 DISPLAY.P$5 | v4.32,267.21 6.6,269.49 6.6,271.02 7.87,272.29 17.78,272.29 17.78,273.3 30.48,286 115.57,286 115.57,159.51
  Bottom 0.61: R124.2 88.39,159.51 v108.71,159.51 | v4.32,267.21 v4.32,253.49
N$119  (via drill 0.38)
  Top 0.61: IC9.7 70.36,157.99 R123.1 | v101.35,179.32 105.41,183.39 105.41,192.79 105.16,193.04 105.16,229.62 105.41,229.87 105.41,282.96 91.95,282.96 90.42,281.43 EXTERNAL.21
  Bottom 0.61: v101.35,179.32 87.38,165.35 74.68,165.35 72.39,163.07 70.87,163.07 70.61,162.81 R123.1
N$120
  Top 0.61: R126.1 34.04,155.19 R125.2
  Bottom 0.61: R127.2 61.98,167.39 43.18,167.39 33.78,157.99 33.78,155.45 R125.2
N$121
  Top 0.61: R127.1 IC9.6
N$122
  Top 0.61: R124.1 83.06,154.69 83.06,160.27 R123.2
  Bottom 0.61: IC9.5 80.26,162.81 R123.2
N$123
  Top 0.61: R110.2 9.91,126.75 POT5.P$2
N$124  (via drill 0.38)
  Top 0.61: v44.45,166.37 24.38,186.44 v24.38,204.22 | v24.13,206.76 22.35,206.76 22.35,207.26 21.84,207.77 18.54,207.77 18.54,191.77 v14.99,188.21 | v16.51,186.69 17.53,185.67 17.53,160.02 17.27,159.77 17.27,147.83 17.53,147.57 17.53,134.62 15.49,132.59 15.49,120.65 POT5.P$4
  Bottom 0.61: IC10.2 53.34,160.78 52.07,160.78 46.48,166.37 v44.45,166.37 | v24.38,204.22 24.38,206.76 v24.13,206.76 | v16.51,186.69 v14.99,188.21
N$125
  Top 0.61: R111.2 9.91,111.76 POT5.P$1
N$126
  Top 0.61: C16.1 U$5.P$3
N$127
  Top 0.61: U$5.P$4 119.38,189.23 C16.2
N$128  (via drill 0.38)
  Top 1.016: U$5.P$5 120.9,190.75 120.9,173.99 C17.2 | R131.2 137.41,179.58 | 137.41,179.58 R117.2 | 137.41,179.58 137.41,194.56 | 137.41,194.56 D20.A 139.95,213.61 139.95,234.44 148.59,243.08 148.59,280.92 173.74,280.92 OUT.P$5 | 137.41,194.56 v129.54,194.56
  Bottom 1.016: U$5.P$5 124.71,194.56 v129.54,194.56
N$129
  Bottom 0.61: D20.C D19.C
N$130
  Top 0.61: R130.1 R129.2
N$131
  Top 0.61: R132.1 R133.2
N$132
  Top 0.61: R133.1 R134.1
N$133
  Top 0.61: R131.1 R130.2
N$134
  Top 0.61: D21.C D22.C
N$135
  Top 0.61: R138.2 69.6,182.63 IC11.2
  Bottom 0.61: R137.1 81.03,179.58 72.9,179.58 72.64,179.83 R138.2
N$136
  Bottom 0.61: IC11.3 67.82,188.47 66.04,188.47 61.21,193.29 61.21,196.85 54.36,196.85 54.1,197.1 R139.1
N$137
  Top 0.61: R141.1 R140.2 R139.2
N$138
  Top 0.61: R138.1 58.67,183.39 IC12.8
  Bottom 0.61: IC11.1 62.99,180.09 62.74,180.09 62.48,179.83 R138.1
N$139
  Top 0.61: R142.1 R143.2
N$140
  Top 0.61: R143.1 R144.2
N$141
  Top 0.61: R144.1 R145.2
N$142
  Top 0.61: R145.1 R146.2
N$143  (via drill 0.38)
  Top 0.61: R146.1 R147.2 | v129.29,184.66 133.6,180.34 133.6,179.07 134.37,178.31 v144.78,178.31 | v6.6,251.21 6.6,246.89 12.19,241.3 12.19,229.11 15.24,226.06 DISPLAY.P$6 | v20.32,272.54 23.62,275.84 64.77,275.84 64.77,214.38 v65.79,213.36
  Bottom 0.61: v129.29,184.66 95.5,184.66 R149.2 87.12,193.29 86.61,193.29 81.03,198.88 80.26,198.88 v65.79,213.36 | v144.78,178.31 148.59,182.12 159,182.12 165.1,176.02 172.21,176.02 182.12,166.12 183.64,166.12 183.9,165.86 R146.1 | v6.6,251.21 17.53,262.13 17.53,270.51 19.05,270.51 20.32,271.78 v20.32,272.54
N$144  (via drill 0.38)
  Top 0.61: IC11.7 69.85,192.02 R148.1 69.85,199.64 73.91,203.71 73.91,218.69 v75.95,220.73 | v88.9,270.26 92.96,274.32 92.96,281.43 EXTERNAL.22 | v91.19,267.97 91.19,235.97 v86.87,231.65
  Bottom 0.61: v91.19,267.97 v88.9,270.26 | v75.95,220.73 v86.87,231.65
N$145  (via drill 0.38)
  Top 0.61: R151.1 33.53,184.91 33.53,188.47 | R150.2 33.53,188.47 | v45.47,203.71 39.88,198.12 39.88,194.56 33.78,188.47 33.53,188.47
  Bottom 0.61: R152.2 58.42,203.71 v45.47,203.71
N$146
  Top 0.61: R152.1 IC11.6
N$147
  Top 0.61: R149.1 80.01,189.99 R148.2
  Bottom 0.61: IC11.5 78.99,196.09 79.5,196.09 79.76,196.34 R148.2
N$148
  Top 0.61: R135.2 9.91,152.91 POT6.P$2
N$149  (via drill 0.38)
  Top 0.61: IC12.2 55.12,193.29 55.12,204.98 v53.34,206.76 | v35.81,224.28 35.05,225.04 35.05,258.06 29.21,263.91 v24.13,263.91 | v24.13,261.11 23.88,260.86 23.88,214.38 17.02,207.52 17.02,201.17 16.51,200.66 12.19,200.66 v12.19,146.3
  Bottom 0.61: v35.81,224.28 v53.34,206.76 | v24.13,261.11 v24.13,263.91 | v12.19,146.3 12.7,145.8 15.24,145.8 POT6.P$4
N$150
  Top 0.61: R136.2 9.91,135.38 POT6.P$1
N$151
  Top 0.61: U$6.P$3 171.2,191.77 C18.1
N$152
  Top 0.61: U$6.P$4 178.82,189.23 C18.2
N$153  (via drill 0.38)
  Top 1.016: U$6.P$5 180.34,191.26 180.34,175.26 C19.2 | R156.2 196.6,180.85 | 196.6,180.85 R142.2 | 196.6,194.82 D24.A 189.74,217.93 189.74,271.27 OUT.P$6 | 196.6,194.82 196.6,180.85 | 196.6,194.82 v188.72,194.82
  Bottom 1.016: U$6.P$5 183.9,194.82 v188.72,194.82
N$154
  Bottom 0.61: D24.C D23.C
N$155
  Top 0.61: R155.1 R154.2
N$156
  Top 0.61: R157.1 R158.2
N$157
  Top 0.61: R158.1 R159.1
N$158
  Top 0.61: R156.1 R155.2
N$159
  Bottom 0.61: D26.C 102.62,229.11 106.93,229.11 107.19,228.85 D25.C
N$160
  Top 0.61: R163.2 70.1,213.36 IC13.2
  Bottom 0.61: R162.1 80.01,211.07 72.64,211.07 72.39,211.33 R163.2
N$161
  Bottom 0.61: R164.1 56.64,227.33 60.2,227.33 67.56,219.96 70.61,219.96 72.64,217.93 IC13.3
N$162
  Top 0.61: R166.1 44.2,220.47 R165.2 R164.2
N$163
  Top 0.61: R163.1 59.18,214.12 IC14.8
  Bottom 0.61: IC13.1 62.23,211.33 R163.1
N$164
  Top 0.61: R167.1 R168.2
N$165
  Top 0.61: R168.1 R169.2
N$166
  Top 0.61: R169.1 R170.2
N$167
  Top 0.61: R170.1 R171.2
N$168  (via drill 0.38)
  Top 0.61: R171.1 R172.2 | v103.12,225.81 R174.2 87.38,225.81 87.38,224.28 83.57,224.28 82.8,225.04 82.8,230.63 v79.5,233.93 | v17.53,246.38 17.53,232.16 15.49,230.12 DISPLAY.P$7 | v18.54,263.65 23.11,263.65 23.11,264.41 23.62,264.92 41.66,264.92 46.74,259.84 v46.74,247.65
  Bottom 0.61: v103.12,225.81 106.43,222.5 123.95,222.5 124.21,222.25 R171.1 | v17.53,246.38 17.53,260.86 18.54,261.87 v18.54,263.65 | v46.74,247.65 60.45,233.93 v79.5,233.93
N$169  (via drill 0.38)
  Top 0.61: IC13.7 R173.1 70.1,230.38 74.42,234.7 74.42,256.79 v75.44,257.81 | EXTERNAL.23 95.76,275.59 81.28,261.11 v79.25,261.11
  Bottom 0.61: v79.25,261.11 75.95,257.81 v75.44,257.81
N$170  (via drill 0.38)
  Top 0.61: R176.1 33.53,219.46 R175.2 36.58,221.23 39.88,224.54 39.88,227.33 v45.47,232.92
  Bottom 0.61: R177.2 60.71,232.92 v45.47,232.92
N$171
  Top 0.61: R177.1 IC13.6
N$172
  Top 0.61: R174.1 80.26,223.01 R173.2
  Bottom 0.61: IC13.5 79.25,228.35 79.76,228.35 80.01,228.6 R173.2
N$173
  Top 0.61: R160.2 9.91,176.78 POT7.P$2
N$174  (via drill 0.38)
  Top 0.61: v45.47,220.47 39.88,214.88 39.88,214.38 37.85,212.34 26.67,212.34 v26.67,208.79 | v23.62,207.77 21.34,210.06 v21.34,210.31 | v19.05,212.34 7.62,212.34 7.62,189.48 7.11,188.98 7.11,184.15 v10.41,180.85
  Bottom 0.61: IC14.2 53.09,220.47 v45.47,220.47 | v26.67,208.79 25.65,207.77 v23.62,207.77 | v21.34,210.31 19.3,212.34 v19.05,212.34 | v10.41,180.85 14.99,176.28 14.99,170.18 15.24,170.18 POT7.P$4
N$175
  Top 0.61: R161.2 9.91,160.78 POT7.P$1
N$176
  Top 0.61: U$7.P$3 112.78,246.89 C20.1
N$177
  Top 0.61: U$7.P$4 120.4,244.35 C20.2
N$178  (via drill 0.38)
  Top 1.016: U$7.P$5 121.92,230.89 C21.2 | R181.2 137.16,239.01 | 137.16,239.01 R167.2 | 137.16,251.97 137.16,264.16 D28.A 138.43,265.43 138.43,279.4 v140.21,281.18 | 137.16,251.97 137.16,239.01 | OUT.P$7 183.64,283.72 v142.75,283.72 | 137.16,251.97 v126.24,251.97
  Bottom 1.016: v140.21,281.18 v142.75,283.72 | U$7.P$5 125.98,251.97 v126.24,251.97
N$179
  Bottom 0.61: D28.C D27.C
N$180
  Top 0.61: R180.1 R179.2
N$181
  Top 0.61: R182.1 R183.2
N$182
  Top 0.61: R183.1 R184.1
N$183
  Top 0.61: R181.1 R180.2
N$184
  Bottom 0.61: D30.C 165.35,173.23 165.61,172.97 D29.C
N$185
  Top 0.61: IC15.2 R188.2
  Bottom 0.61: R187.1 82.04,241.55 71.12,241.55 70.87,241.81 R188.2
N$186  (via drill 0.38)
  Top 0.61: R189.1 62.74,260.35 v62.74,254
  Bottom 0.61: v62.74,254 66.55,250.19 69.85,250.19 IC15.3
N$187
  Top 0.61: R191.1 44.45,252.22 R190.2 R189.2
N$188
  Top 0.61: R188.1 59.44,242.82 IC16.8
  Bottom 0.61: IC15.1 67.82,247.14 59.69,247.14 IC16.8
N$189
  Top 0.61: R192.1 R193.2
N$190
  Top 0.61: R193.1 R194.2
N$191
  Top 0.61: R194.1 R195.2
N$192
  Top 0.61: R195.1 R196.2
N$193  (via drill 0.38)
  Top 0.61: R197.2 R196.1 183.64,223.77 182.37,225.04 182.37,248.41 178.56,252.22 178.56,265.43 179.83,266.7 179.83,282.45 136.65,282.45 | v117.6,260.86 120.14,263.4 120.14,265.94 136.65,282.45 | v3.3,277.11 6.6,280.42 6.6,282.96 12.19,288.54 136.65,288.54 136.65,282.45
  Bottom 0.61: R199.2 92.46,260.86 v117.6,260.86 | v3.3,277.11 3.3,248.41 7.62,244.09 15.24,244.09 15.24,234.44 DISPLAY.P$8
N$194
  Top 0.61: R198.1 IC15.7
  Bottom 0.61: R198.1 70.87,258.57 70.87,264.16 82.3,275.59 95.76,275.59 95.76,279.4 96.77,280.42 97.28,280.42 98.3,281.43 EXTERNAL.24
N$195
  Top 0.61: R201.1 33.78,252.98 R200.2
  Bottom 0.61: R202.2 62.99,262.89 41.4,262.89 33.78,255.27 R200.2
N$196
  Top 0.61: IC15.6 73.41,254.76 R202.1
N$197
  Top 0.61: IC15.5 80.77,254.51 80.77,257.56 | R198.2 80.77,257.56 | R199.1 84.84,250.19 84.84,255.78 83.06,257.56 80.77,257.56
N$198
  Top 0.61: R185.2 9.91,204.72 POT8.P$2
N$199  (via drill 0.38)
  Top 0.61: IC16.2 49.28,262.13 v49.28,263.91 | v45.72,264.16 43.69,264.16 41.91,265.94 22.1,265.94 v22.1,264.67 | v22.86,261.11 22.35,260.6 22.35,214.12 16,207.77 v16,201.68
  Bottom 0.61: v49.28,263.91 49.02,264.16 v45.72,264.16 | v22.1,264.67 22.86,263.91 v22.86,261.11 | v16,201.68 16,198.63 15.49,198.63 POT8.P$4
N$200
  Top 0.61: R186.2 9.91,189.99 POT8.P$1
N$201
  Top 0.61: U$8.P$3 170.69,247.65 C22.1
N$202
  Top 0.61: U$8.P$4 178.31,245.62 C22.2
N$203
  Top 1.016: U$8.P$5 179.83,246.63 179.83,231.14 C23.2 | R206.2 196.6,238.51 | 196.6,238.51 R192.2 | 196.6,238.51 D32.A 196.85,264.92 196.85,276.35 OUT.P$8
  Bottom 1.016: U$8.P$5 196.34,263.14 196.34,264.67 D32.A
N$204
  Bottom 0.61: D32.C D31.C
N$205
  Top 0.61: R205.1 R204.2
N$206
  Top 0.61: R207.1 R208.2
N$207
  Top 0.61: R208.1 R209.1
N$208
  Top 0.61: R206.1 R205.2
N$209
  Top 0.61: D33.C D34.C
V+
  Bottom 1.016: D2.C 186.56,23.75 HVIN.P$4 | D2.C C3.1 | D2.C 182.12,28.19 Q2.3 R8.2
V+_SAFE
  Bottom 1.016: Q1.1 164.85,45.72 | 164.85,45.72 179.83,45.72 186.69,45.97 189.99,45.97 191.26,47.24 U$1.P$7 191.26,135.89 U$3.P$7 U$6.P$7 U$8.P$7 | 164.85,45.72 131.83,45.72 U$4.P$7 131.83,135.64 U$2.P$7 U$5.P$7 U$7.P$7
V-
  Top 1.016: HVIN.P$3 190.75,32 187.45,35.31 177.29,35.31 172.97,30.99 153.42,30.99 C4.1 | C4.1 D3.A | C4.1 147.57,25.15 134.37,25.15 129.79,29.72 T1.3 R11.1
V-_SAFE
  Top 1.016: T2.1 109.98,42.16 109.98,44.2 111.76,45.97 125.73,45.97 | 125.73,45.97 126.75,46.99 U$4.P$6 127,77.98 U$2.P$6 U$5.P$6 U$7.P$6 | 125.73,45.97 183.64,45.97 186.44,48.51 186.44,77.72 U$1.P$6 186.44,78.23 U$3.P$6 U$6.P$6 U$8.P$6
VIN+  (via drill 0.38)
  Top 0.61: IC14.1 58.29,223.14 | 58.29,223.14 57.91,222.76 57.91,193.04 IC12.1 58.67,192.02 57.4,190.75 57.4,159.51 58.93,157.99 IC10.1 57.66,156.46 57.66,120.65 | IC16.1 59.18,254.25 59.18,249.17 58.17,248.16 58.17,223.27 58.29,223.14 | 57.66,120.65 57.66,88.39 IC6.1 58.67,87.12 59.94,85.85 59.94,53.34 IC4.1 59.18,52.32 60.45,51.05 60.45,43.69 59.44,42.67 IC3.1 | IC8.1 57.66,120.65 | U$8.P$2 D13.A 165.86,239.01 167.39,237.49 167.39,212.09 165.86,210.57 U$6.P$2 166.12,191.77 D29.A 166.12,182.88 164.59,181.36 164.59,137.92 166.12,136.4 U$3.P$2 D17.A 166.12,125.48 164.34,123.7 164.34,79.76 165.86,78.23 U$1.P$2 D5.A 165.86,67.56 172.21,61.21 172.21,56.64 171.2,55.63 139.7,55.63 139.7,57.4 137.92,59.18 130.56,59.18 v130.56,68.83 | U$7.P$2 107.7,246.89 D25.A 107.7,238.76 106.43,237.49 106.43,229.62 106.17,229.36 106.17,193.29 106.68,192.79 U$5.P$2 D33.A 106.68,181.61 108.2,180.09 108.2,168.4 106.68,166.88 U$2.P$2 D21.A 106.68,125.48 108.2,123.95 108.2,115.06 106.43,113.28 U$4.P$2 D9.A
  Bottom 0.61: v130.56,68.83 128.27,71.12 109.22,71.12 106.68,68.58 D9.A | IC8.1 62.48,118.36 76.96,118.36 87.12,128.52 103.63,128.52 106.43,125.73 D21.A
VIN-  (via drill 0.38)
  Top 0.61: U$7.P$1 102.36,246.13 D26.A 102.36,238.76 104.14,236.98 U$5.P$1 101.85,189.48 D34.A 101.85,181.61 100.33,180.09 100.33,164.85 104.14,161.04 U$2.P$1 101.85,133.6 D22.A 101.85,125.48 100.33,123.95 100.33,81.53 103.89,77.98 U$4.P$1 101.6,75.44 D10.A 101.6,68.07 C7.1 | R204.1 R207.2 207.77,227.08 210.31,224.54 210.31,174.75 209.04,173.48 R154.1 R157.2 209.04,169.42 207.52,167.89 207.52,118.36 208.79,117.09 R104.1 208.79,114.3 | R57.2 R54.1 207.52,60.2 210.06,62.74 210.06,111.51 208.79,112.78 R107.2 208.79,114.3 | R179.1 R182.2 148.59,226.06 147.32,224.79 147.32,214.63 148.97,212.98 | 148.97,212.98 163.32,198.63 U$6.P$1 161.54,190.25 D30.A 161.54,183.13 150.11,171.7 R129.1 R132.2 149.86,167.39 163.58,153.67 U$3.P$1 161.8,134.37 161.8,129.79 | C19.1 172.72,175.26 172.72,226.82 170.43,229.11 C23.1 168.4,231.39 168.4,247.14 166.37,249.17 163.32,249.17 U$8.P$1 161.04,245.62 D14.A 161.04,239.01 159.51,237.49 159.51,223.52 148.97,212.98 | R5.2 R4.1 148.84,60.45 149.48,61.09 | 159.51,70.87 D6.A 159.77,68.58 C11.1 | 159.51,70.87 159.51,74.17 U$1.P$1 163.32,78.23 149.86,91.69 149.86,111.76 148.59,113.03 R82.2 R79.1 148.84,117.09 161.54,129.79 161.8,129.79 | 149.48,61.09 159.26,70.87 159.51,70.87 | D18.A 161.8,129.79 | v188.98,114.3 208.79,114.3 | v185.17,111.25 173.74,111.25 C15.1 | v128.02,69.85 133.1,69.85 133.1,66.8 134.87,65.02 147.32,65.02 147.32,63.25 149.48,61.09
  Bottom 0.61: C21.1 102.36,238.76 D26.A | C17.1 101.85,181.36 D34.A | D22.A C13.1 | C15.1 166.37,122.94 164.59,122.94 162.05,125.48 D18.A | v188.98,114.3 185.93,111.25 v185.17,111.25 | C7.1 118.36,66.04 120.4,66.04 124.21,69.85 v128.02,69.85